# Altium project AGV_Control.PrjPcb
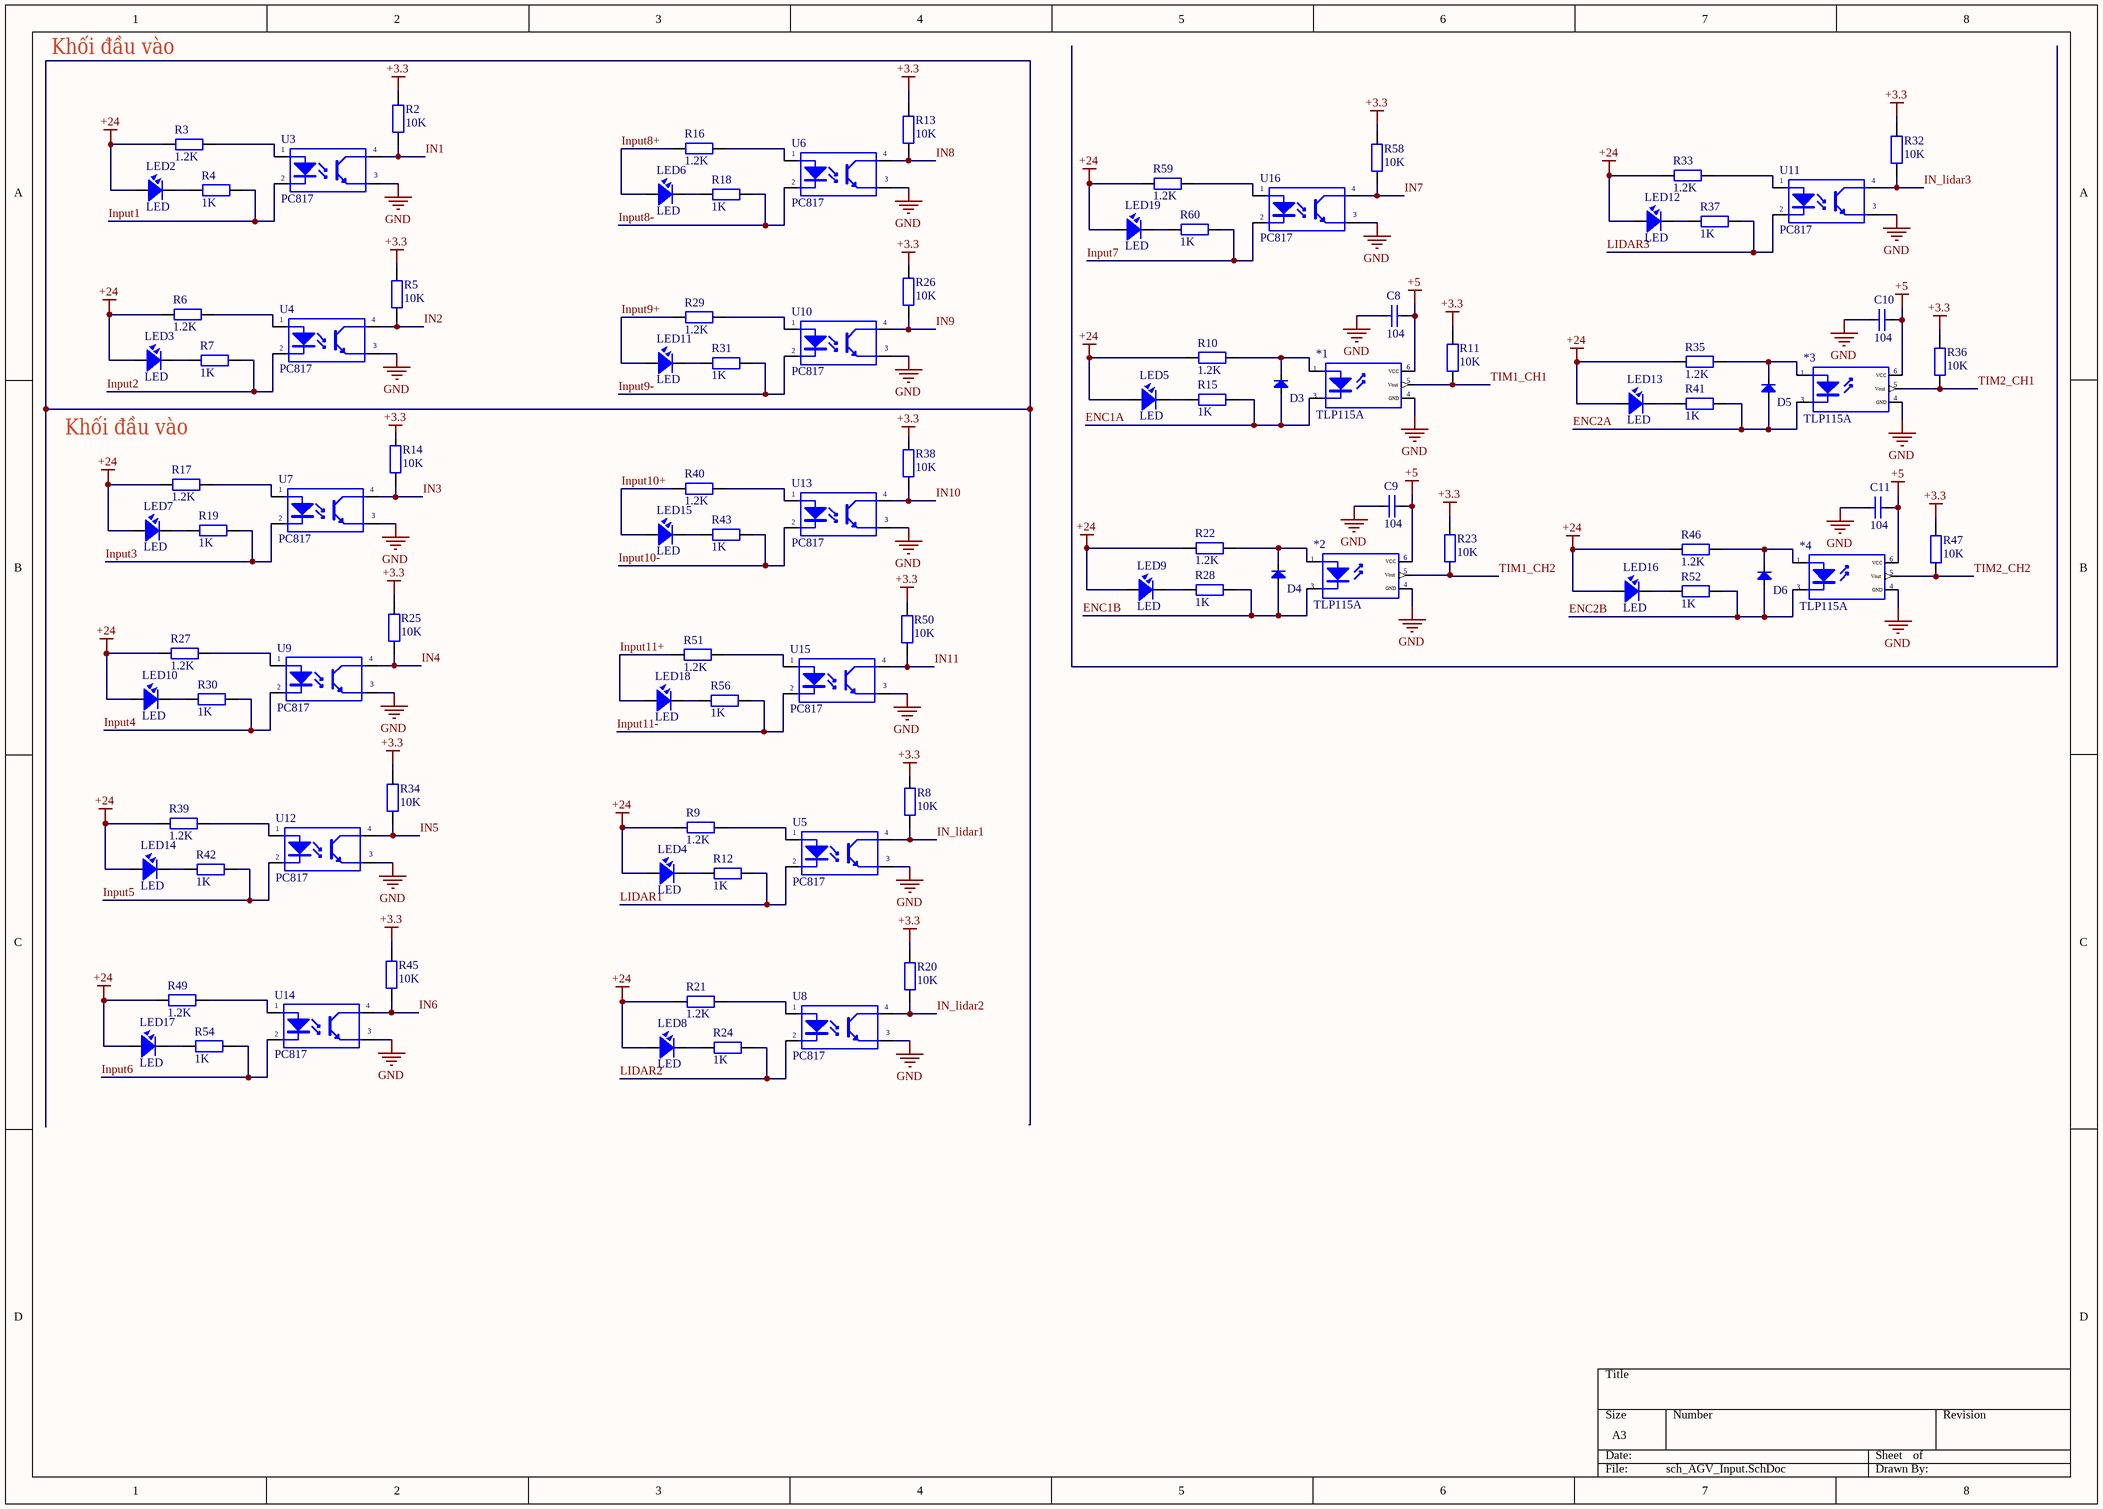
[diagram p0: sch_AGV_Input.SchDoc]
1 sheet, 98 parts. Net scope: global (net labels, ports and power ports of the same name join across sheets).
Board file: pcb_AGV_Control.PcbDoc

## Sheet sch_AGV_Input.SchDoc
size A3; SheetNumber: 2; SheetTotal: 6

### Parts
*1  TLP115A  [SOP5]
*2  TLP115A  [SOP5]
*3  TLP115A  [SOP5]
*4  TLP115A  [SOP5]
C8  104  [CAP_0805]
C9  104  [CAP_0805]
C10  104  [CAP_0805]
C11  104  [CAP_0805]
D3  Diode  [DIO-214AC(SMA)]  (value not drawn)
D4  Diode  [DIO-214AC(SMA)]  (value not drawn)
D5  Diode  [DIO-214AC(SMA)]  (value not drawn)
D6  Diode  [DIO-214AC(SMA)]  (value not drawn)
LED2  LED  [LED_BLUE_SMD_0805]
LED3  LED  [LED_BLUE_SMD_0805]
LED4  LED  [LED_BLUE_SMD_0805]
LED5  LED  [LED_BLUE_SMD_0805]
LED6  LED  [LED_BLUE_SMD_0805]
LED7  LED  [LED_BLUE_SMD_0805]
LED8  LED  [LED_BLUE_SMD_0805]
LED9  LED  [LED_BLUE_SMD_0805]
LED10  LED  [LED_BLUE_SMD_0805]
LED11  LED  [LED_BLUE_SMD_0805]
LED12  LED  [LED_BLUE_SMD_0805]
LED13  LED  [LED_BLUE_SMD_0805]
LED14  LED  [LED_BLUE_SMD_0805]
LED15  LED  [LED_BLUE_SMD_0805]
LED16  LED  [LED_BLUE_SMD_0805]
LED17  LED  [LED_BLUE_SMD_0805]
LED18  LED  [LED_BLUE_SMD_0805]
LED19  LED  [LED_BLUE_SMD_0805]
R2  10K  [RES_SMD_0805]
R3  1.2K  [RES_SMD_0805]
R4  1K  [RES_SMD_0805]
R5  10K  [RES_SMD_0805]
R6  1.2K  [RES_SMD_0805]
R7  1K  [RES_SMD_0805]
R8  10K  [RES_SMD_0805]
R9  1.2K  [RES_SMD_0805]
R10  1.2K  [RES_SMD_0805]
R11  10K  [RES_SMD_0805]
R12  1K  [RES_SMD_0805]
R13  10K  [RES_SMD_0805]
R14  10K  [RES_SMD_0805]
R15  1K  [RES_SMD_0805]
R16  1.2K  [RES_SMD_0805]
R17  1.2K  [RES_SMD_0805]
R18  1K  [RES_SMD_0805]
R19  1K  [RES_SMD_0805]
R20  10K  [RES_SMD_0805]
R21  1.2K  [RES_SMD_0805]
R22  1.2K  [RES_SMD_0805]
R23  10K  [RES_SMD_0805]
R24  1K  [RES_SMD_0805]
R25  10K  [RES_SMD_0805]
R26  10K  [RES_SMD_0805]
R27  1.2K  [RES_SMD_0805]
R28  1K  [RES_SMD_0805]
R29  1.2K  [RES_SMD_0805]
R30  1K  [RES_SMD_0805]
R31  1K  [RES_SMD_0805]
R32  10K  [RES_SMD_0805]
R33  1.2K  [RES_SMD_0805]
R34  10K  [RES_SMD_0805]
R35  1.2K  [RES_SMD_0805]
R36  10K  [RES_SMD_0805]
R37  1K  [RES_SMD_0805]
R38  10K  [RES_SMD_0805]
R39  1.2K  [RES_SMD_0805]
R40  1.2K  [RES_SMD_0805]
R41  1K  [RES_SMD_0805]
R42  1K  [RES_SMD_0805]
R43  1K  [RES_SMD_0805]
R45  10K  [RES_SMD_0805]
R46  1.2K  [RES_SMD_0805]
R47  10K  [RES_SMD_0805]
R49  1.2K  [RES_SMD_0805]
R50  10K  [RES_SMD_0805]
R51  1.2K  [RES_SMD_0805]
R52  1K  [RES_SMD_0805]
R54  1K  [RES_SMD_0805]
R56  1K  [RES_SMD_0805]
R58  10K  [RES_SMD_0805]
R59  1.2K  [RES_SMD_0805]
R60  1K  [RES_SMD_0805]
U3  PC817  [DIP4/W0.3]
U4  PC817  [DIP4/W0.3]
U5  PC817  [DIP4/W0.3]
U6  PC817  [DIP4/W0.3]
U7  PC817  [DIP4/W0.3]
U8  PC817  [DIP4/W0.3]
U9  PC817  [DIP4/W0.3]
U10  PC817  [DIP4/W0.3]
U11  PC817  [DIP4/W0.3]
U12  PC817  [DIP4/W0.3]
U13  PC817  [DIP4/W0.3]
U14  PC817  [DIP4/W0.3]
U15  PC817  [DIP4/W0.3]
U16  PC817  [DIP4/W0.3]

### Nets
+3.3: R2.1 R5.1 R8.1 R11.1 R13.1 R14.1 R20.1 R23.1 R25.1 R26.1 R32.1 R34.1 R36.1 R38.1 R45.1 R47.1 R50.1 R58.1
+5: *1.6(C) *2.6(C) *3.6(C) *4.6(C) C8.2 C9.2 C10.2 C11.2
+24: LED2.1 LED3.1 LED4.1 LED5.1 LED7.1 LED8.1 LED9.1 LED10.1 LED12.1 LED13.1 LED14.1 LED16.1 LED17.1 LED19.1 R3.1 R6.1 R9.1 R10.1 R17.1 R21.1 R22.1 R27.1 R33.1 R35.1 R39.1 R46.1 R49.1 R59.1
GND: *1.4(E) *2.4(E) *3.4(E) *4.4(E) C8.1 C9.1 C10.1 C11.1 U3.3(E) U4.3(E) U5.3(E) U6.3(E) U7.3(E) U8.3(E) U9.3(E) U10.3(E) U11.3(E) U12.3(E) U13.3(E) U14.3(E) U15.3(E) U16.3(E)
ENC1A: *1.3(K) D3.1(A) R15.2
ENC1B: *2.3(K) D4.1(A) R28.2
ENC2A: *3.3(K) D5.1(A) R41.2
ENC2B: *4.3(K) D6.1(A) R52.2
IN1: R2.2 U3.4(C)
IN2: R5.2 U4.4(C)
IN3: R14.2 U7.4(C)
IN4: R25.2 U9.4(C)
IN5: R34.2 U12.4(C)
IN6: R45.2 U14.4(C)
IN7: R58.2 U16.4(C)
IN8: R13.2 U6.4(C)
IN9: R26.2 U10.4(C)
IN10: R38.2 U13.4(C)
IN11: R50.2 U15.4(C)
IN_lidar1: R8.2 U5.4(C)
IN_lidar2: R20.2 U8.4(C)
IN_lidar3: R32.2 U11.4(C)
Input1: R4.2 U3.2(K)
Input2: R7.2 U4.2(K)
Input3: R19.2 U7.2(K)
Input4: R30.2 U9.2(K)
Input5: R42.2 U12.2(K)
Input6: R54.2 U14.2(K)
Input7: R60.2 U16.2(K)
Input8+: LED6.1 R16.1
Input8-: R18.2 U6.2(K)
Input9+: LED11.1 R29.1
Input9-: R31.2 U10.2(K)
Input10+: LED15.1 R40.1
Input10-: R43.2 U13.2(K)
Input11+: LED18.1 R51.1
Input11-: R56.2 U15.2(K)
LIDAR1: R12.2 U5.2(K)
LIDAR2: R24.2 U8.2(K)
LIDAR3: R37.2 U11.2(K)
TIM1_CH1: *1.5(Out) R11.2
TIM1_CH2: *2.5(Out) R23.2
TIM2_CH1: *3.5(Out) R36.2
TIM2_CH2: *4.5(Out) R47.2
Net*1_1: *1.1(A) D3.2(K) R10.2
Net*2_1: *2.1(A) D4.2(K) R22.2
Net*3_1: *3.1(A) D5.2(K) R35.2
Net*4_1: *4.1(A) D6.2(K) R46.2
NetLED2_2: LED2.2 R4.1
NetLED3_2: LED3.2 R7.1
NetLED4_2: LED4.2 R12.1
NetLED5_2: LED5.2 R15.1
NetLED6_2: LED6.2 R18.1
NetLED7_2: LED7.2 R19.1
NetLED8_2: LED8.2 R24.1
NetLED9_2: LED9.2 R28.1
NetLED10_2: LED10.2 R30.1
NetLED11_2: LED11.2 R31.1
NetLED12_2: LED12.2 R37.1
NetLED13_2: LED13.2 R41.1
NetLED14_2: LED14.2 R42.1
NetLED15_2: LED15.2 R43.1
NetLED16_2: LED16.2 R52.1
NetLED17_2: LED17.2 R54.1
NetLED18_2: LED18.2 R56.1
NetLED19_2: LED19.2 R60.1
NetR3_2: R3.2 U3.1(A)
NetR6_2: R6.2 U4.1(A)
NetR9_2: R9.2 U5.1(A)
NetR16_2: R16.2 U6.1(A)
NetR17_2: R17.2 U7.1(A)
NetR21_2: R21.2 U8.1(A)
NetR27_2: R27.2 U9.1(A)
NetR29_2: R29.2 U10.1(A)
NetR33_2: R33.2 U11.1(A)
NetR39_2: R39.2 U12.1(A)
NetR40_2: R40.2 U13.1(A)
NetR49_2: R49.2 U14.1(A)
NetR51_2: R51.2 U15.1(A)
NetR59_2: R59.2 U16.1(A)

### Notes on the sheet
- Khối đầu vào
- (in symbol TLP115A) VCC; Vout; GND

### Library data of the parts
*1-*4 = TLP115A: Photocouple
C8-C11 = CapSMD: Capacitor; Value: 33p; Published: 8-Jun-2000; LatestRevisionDate: 17-Jul-2002; LatestRevisionNote: Re-released for DXP Platform.; PackageReference: RAD-0.3; Publisher: Altium Limited
D3-D6 = Diode: Default Diode; Code - JEDEC: DO-214-AB; Value: 1N5007; Published: 8-Jun-2000; Revision: July-2002: Re-released for DXP Platform.; Publisher: Altium Limited
LED2-LED19 = LED: LED Single colour Green and Red; Value: LED 3 ly Single Colour
R2-R43 R45-R47 R49-R52 R54 R56 R58-R60 = Res: Resistor; Manufacturer: Generic Components; Class: Passive; Published: 08/06/2000; Publisher: Altium Hobart Technology Centre
U3-U16 = PC817: Single Opto; Value: PC817